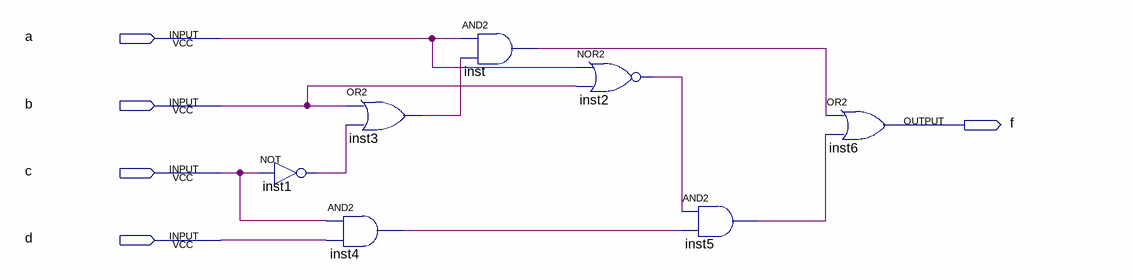
[diagram p0: schematic sheet]
// Quartus schematic Lab2.bdf as structural Verilog: 7 symbols, 5 pins
module Lab2 (
  input  a,
  input  b,
  input  c,
  input  d,
  output f
);

  wire inst1_out, inst2_out, inst3_out, inst4_out, inst5_out, inst_out;

  not inst1 (inst1_out, c);
  or inst3 (inst3_out, b, inst1_out);
  and inst4 (inst4_out, c, d);
  and inst (inst_out, a, inst3_out);
  nor inst2 (inst2_out, a, b);
  and inst5 (inst5_out, inst2_out, inst4_out);
  or inst6 (f, inst_out, inst5_out);
endmodule
